# Altium project Test.PrjPcb
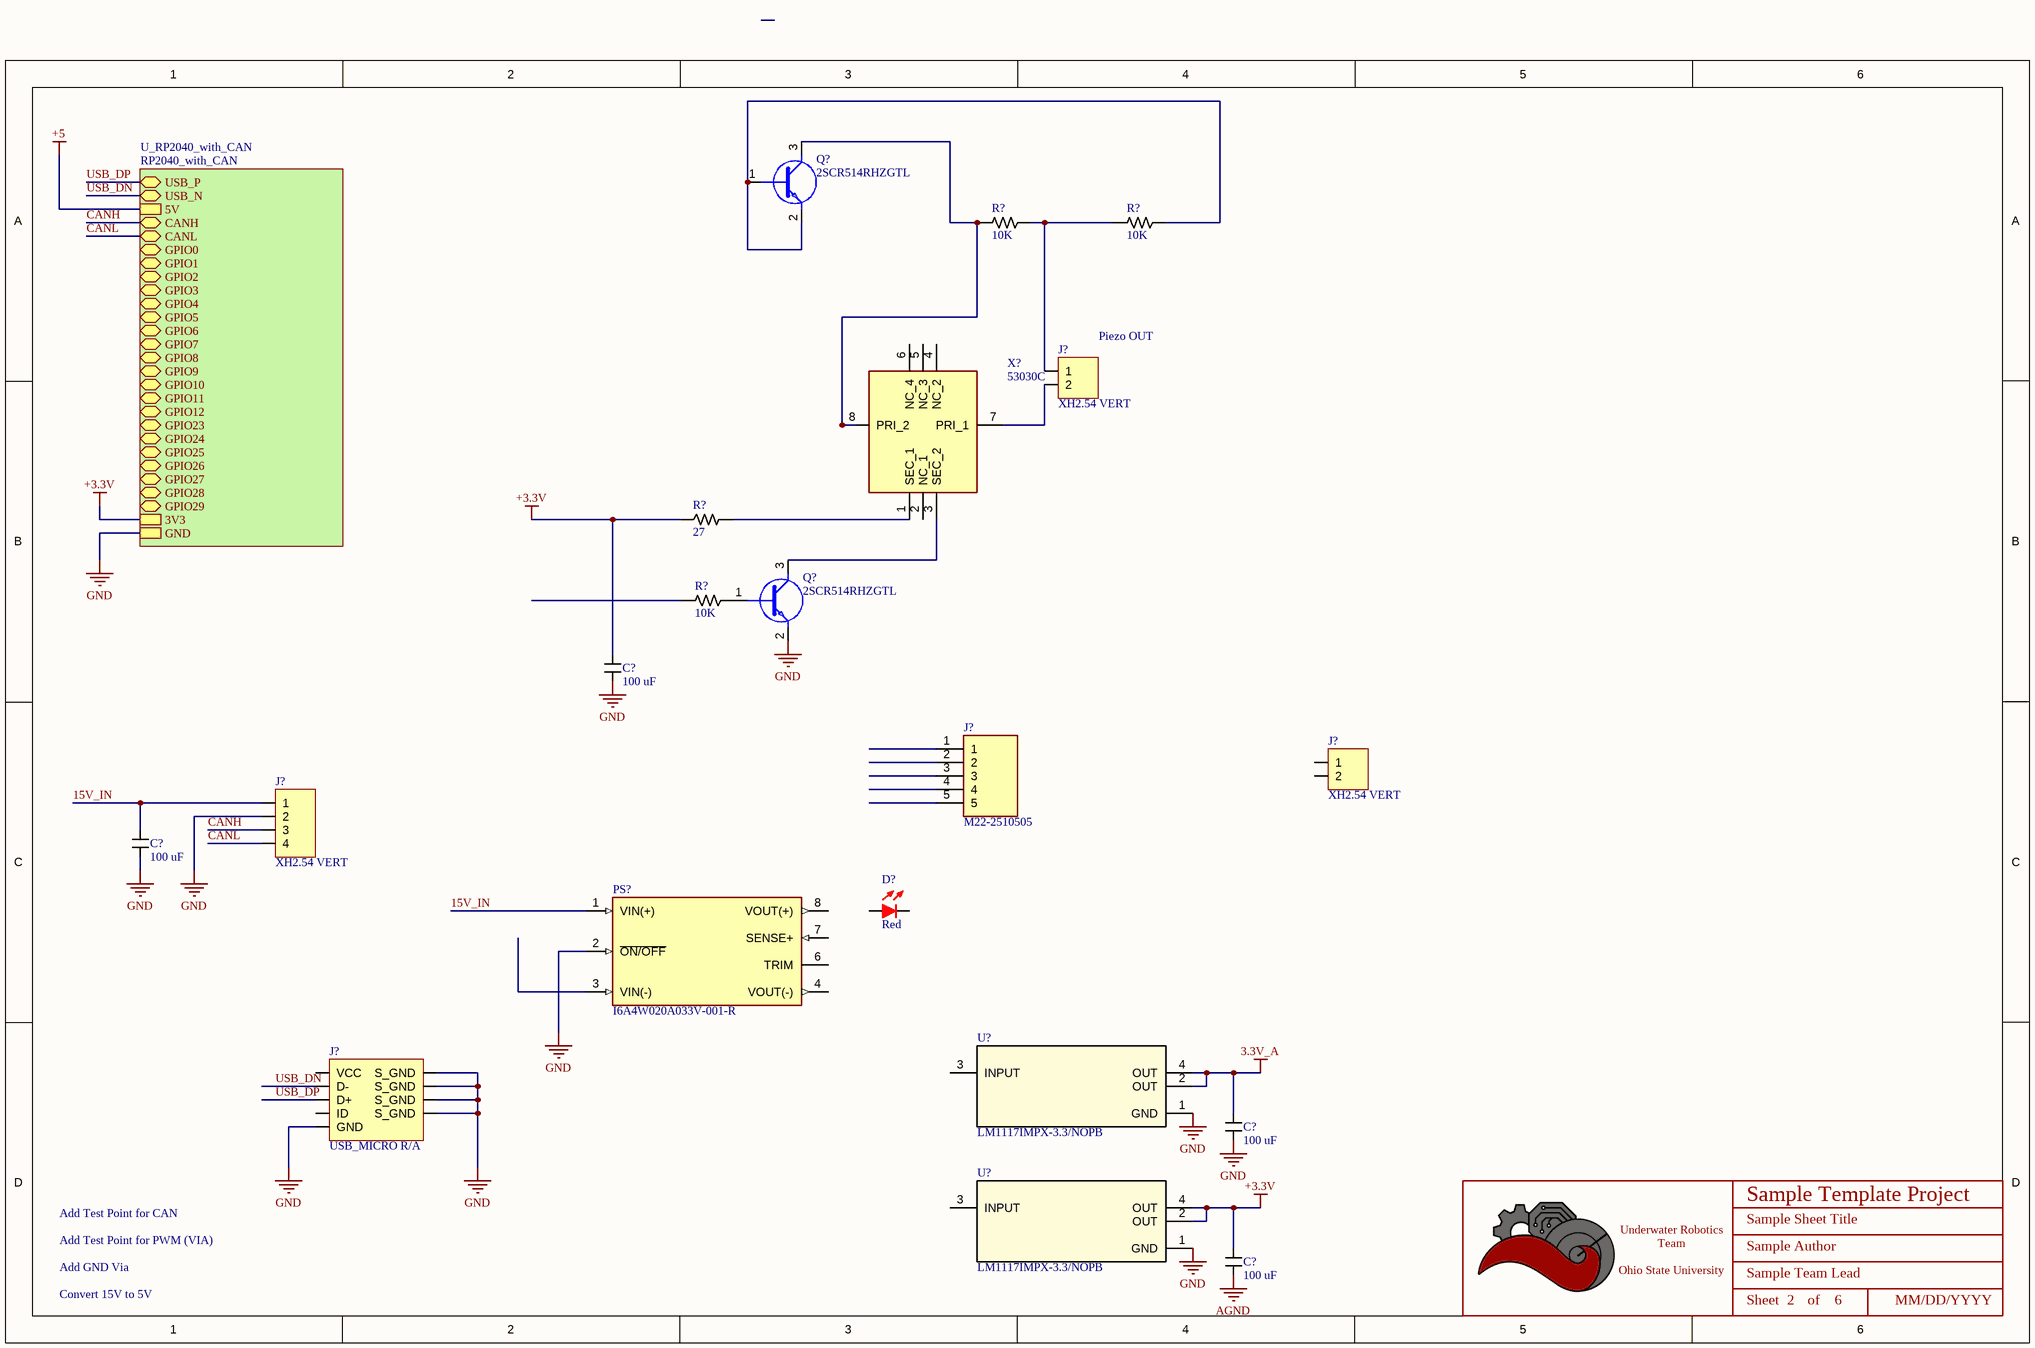
[diagram p0: Sch_Sheet_Template.SchDoc]
BoardRevision: 1.0; DateOfDesignReview: XX/XX/XXXX; ProjectTitle: Sample Template Project; TeamLead: Sample Team Lead
3 sheets, 46 parts. Net scope: hierarchical (ports join the sheet entries above them; power ports are global).
Board file: Pcb_4layer_4x4_Template.PcbDoc
Sheets:
  Sch_Sheet_Template.SchDoc
  TI_DSP.SchDoc
  Hydrophone.SchDoc

## Sheet Sch_Sheet_Template.SchDoc: Sample Sheet Title
size B; Date: MM/DD/YYYY; Author: Sample Author; Organization: ORGANIZATION; Address1: ADDRESS 1; Address2: ADDRESS 2; Address3: ADDRESS 3; Address4: ADDRESS 4; Revision: -; SheetNumber: 2; SheetTotal: 6; ENG_APP_DATE: --/--/--; DSN_APP_DATE: --/--/--; CHK_APP_DATE: --/--/--

### Parts
(Parts that share a designator on the sheet are numbered #1, #2 ... from top to bottom, then left to right.)
*#1  Title_Block  [LOGO]  (value not drawn)  (graphical)
C?#1  Value (uF): 100 uF  [CAPACITOR_0603]  (hidden comment: 100uF Ceramic 6.3V)
C?#2  Value (uF): 100 uF  [CAPACITOR_0603]  (hidden comment: 100uF Ceramic 6.3V)
C?#3  Value (uF): 100 uF  [CAPACITOR_0603]  (hidden comment: 100uF Ceramic 6.3V)
C?#4  Value (uF): 100 uF  [CAPACITOR_0603]  (hidden comment: 100uF Ceramic 6.3V)
D?#1  Color: Red  [LED_0603]  (hidden comment: 150060RS75000)
J?#1  XH2.54 VERT  [CONN_JST_XH254_2POS_VERT]
J?#2  M22-2510505  [HDRV5W50P0X200_1X5_1000X200X525P]
J?#3  XH2.54 VERT  [CONN_JST_XH254_2POS_VERT]
J?#4  XH2.54 VERT  [CONN_JST_XH254_4POS_VERT]
J?#5  USB_MICRO R/A  [CONN_MINIUSB]
PS?  I6A4W020A033V-001-R  [CONV_I6A4W020A033V-001-R]
Q?#1  2SCR514RHZGTL  [SOT95P280X100-3N]
Q?#2  2SCR514RHZGTL  [SOT95P280X100-3N]
R?#1  Value  (Ohms): 10K  [RESISTOR_0603]  (hidden comment: 10k Ohm 5% 1/10W)
R?#2  Value  (Ohms): 10K  [RESISTOR_0603]  (hidden comment: 10k Ohm 5% 1/10W)
R?#3  Value  (Ohms): 27  [RESISTOR_0603]  (hidden comment: 27 Ohm 5% 1/8W)
R?#4  Value  (Ohms): 10K  [RESISTOR_0603]  (hidden comment: 10k Ohm 5% 1/10W)
U?#1  LM1117IMPX-3.3/NOPB  [SOT-223-4]
U?#2  LM1117IMPX-3.3/NOPB  [SOT-223-4]
X?#1  53030C  [53030C]

### Sub-sheets
U_RP2040_with_CAN = RP2040_with_CAN (file not in this document): USB_P (bidir), USB_N (bidir), 5V, CANH (bidir), CANL (bidir), GPIO0 (bidir), GPIO1 (bidir), GPIO2 (bidir), GPIO3 (bidir), GPIO4 (bidir), GPIO5 (bidir), GPIO6 (bidir), GPIO7 (bidir), GPIO8 (bidir), GPIO9 (bidir), GPIO10 (bidir), GPIO11 (bidir), GPIO12 (bidir), GPIO23 (bidir), GPIO24 (bidir), GPIO25 (bidir), GPIO26 (bidir), GPIO27 (bidir), GPIO28 (bidir), GPIO29 (bidir), 3V3, GND

### Nets
3.3V_A: C?#3.1 U?#1.2(OUT) U?#1.4(OUT)
+3.3V: C?#1.1 C?#4.1 R?#3.2 U?#2.2(OUT) U?#2.4(OUT) ; sheet U_RP2040_with_CAN/3V3
AGND: C?#4.2
GND: C?#1.2 C?#2.2 C?#3.2 J?#4.2 J?#5.5(GND) J?#5.6(S_GND) J?#5.7(S_GND) J?#5.8(S_GND) J?#5.9(S_GND) PS?.2(~{ON/OFF}) Q?#2.2(E) U?#1.1(GND) U?#2.1(GND) ; sheet U_RP2040_with_CAN/GND  [project net +1.8]
15V_IN: C?#2.1 J?#4.1 PS?.1(VIN(+))
CANH: J?#4.3 ; sheet U_RP2040_with_CAN/CANH
CANL: J?#4.4 ; sheet U_RP2040_with_CAN/CANL
USB_DN: J?#5.2(D-) ; sheet U_RP2040_with_CAN/USB_N
USB_DP: J?#5.3(D+) ; sheet U_RP2040_with_CAN/USB_P
NetJ?#1_1: J?#1.1 R?#1.2 R?#2.1
NetJ?#1_2: J?#1.2 X?#1.7(PRI_1)
NetQ?#1_1: Q?#1.1(B) Q?#1.2(E) R?#2.2
NetQ?#1_3: Q?#1.3(C) R?#1.1 X?#1.8(PRI_2)
NetQ?#2_1: Q?#2.1(B) R?#4.2
NetQ?#2_3: Q?#2.3(C) X?#1.3(SEC_2)
NetR?#3_1: R?#3.1 X?#1.1(SEC_1)

Not connected (* = marked no-connect by the designer): D?#1 1 2; J?#2 1 2 3 4 5; J?#3 1 2; J?#5 1(VCC) 4(ID); PS? 3(VIN(-)) 4(VOUT(-)) 6(TRIM) 7(SENSE+) 8(VOUT(+)); R?#4 1; U?#1 3(INPUT); U?#2 3(INPUT); X?#1 2(NC_1) 4(NC_2) 5(NC_3) 6(NC_4)

### Notes on the sheet
- (near J?#1) Piezo OUT
- Add Test Point for CAN
- Add Test Point for PWM (VIA)
- Add GND Via
- Convert 15V to 5V
- DWG. NO.
- REV.
- SHT.
- THIS DOCUMENT AND THE DATA DISCLOSED HEREIN OR HEREWITH IS THE PROPERTY OF ALTIUM LIMITED AND MAY BE FREELY DISTRIBUTED IN WHOLE. NO RIGHTS ARE RESERVED OR EXPRESS OR IMPLIED WARANTEE GIVEN.
- REVISION
- DESCRIPTION
- DATE
- APPROVED
- ENG:
- APPROVALS
- PROJECT
- DSN:
- CHK:
- REFERENCE DOCUMENTS
- PROJECT REVISION:
- TITLE
- DOCUMENT REVISION:
- DESIGN ITEM:
- BOM:
- FAB DWG:
- PCB DWG:
- ASSY DWG:
- SCALE:
- SIZE
- B
- CAGE CODE
- FILE NAME
- DWG NO.
- SHEET
- OF
- REV
- (in symbol Title_Block) Underwater Robotics Team / Ohio State University; Sheet; of

### Library data of the parts
*#1 = Title_Block: UWRT Schematic Title Block Template / Created June 2021, Dylan Trainor
C?#1-C?#4 = CAPACITOR_100uF_0603: Cap 100uF 6.3V +/-20% / Ceramic 0603; Made By: Dylan Trainor; ComponentLink1Description: Digikey; ComponentLink1URL: https://www.digikey.com/en/products/detail/samsung-electro-mechanics/CL10A106MQ8NNNC/3886777; Tolerance: +/- 20%; Voltage: 6.3V; Supplier 1: RSComponents; Supplier Part Number 1: 6911206
D?#1 = LED_Red_0603: LED Red Vf= 2V If = 0.020A / 150060RS75000; Made By: Robert Pafford; Forward Current: 20mA; Forward Voltage: 2V; Package: 0603; Supplier 1: Digi-Key; Supplier Part Number 1: 732-4978-1-ND
J?#1 J?#3 = CONN_JST_XH254_2POS_VERT: JST XH 2.54mm Pitch 2 Pos Vertical; Current Per Pin: 4A; Number of Positions: 2; NOTE: Do not use JST 2.5mm parts with this footprint. JST does not make 2.54mm pitch pins, rather only clones make this connector!; Manufacturer: JST; Pitch: 2.54mm; Configuration: Vertical; Color: White; Created By: Robert P; Series: XH 2.54; ComponentLink1Description: Purchase Link; ComponentLink1URL: https://www.amazon.com/460PCS-XH2-54-Connector-Terminal-Connectors/dp/B09DBGVX5C
J?#2 = M22-2510505: Connector; Manufacturer_Name: Harwin; Datasheet Link: https://cdn.harwin.com/pdfs/M22-251.pdf; Height: 5.25mm; Manufacturer_Part_Number: M22-2510505; Mouser Part Number: 855-M22-2510505; Mouser Price/Stock: https://www.mouser.co.uk/ProductDetail/Harwin/M22-2510505?qs=WS5Jv%252B%252Bx1qWs6dQLMQlLFg%3D%3D
J?#4 = CONN_JST_XH254_4POS_VERT: JST XH 2.54mm Pitch 4 Pos Vertical; Current Per Pin: 4A; Number of Positions: 4; NOTE: Do not use JST 2.5mm parts with this footprint. JST does not make 2.54mm pitch pins, rather only clones make this connector!; Manufacturer: JST; Pitch: 2.54mm; Configuration: Vertical; Color: White; Created By: Robert P; Series: XH 2.54; ComponentLink1Description: Purchase Link; ComponentLink1URL: https://www.amazon.com/460PCS-XH2-54-Connector-Terminal-Connectors/dp/B09DBGVX5C
J?#5 = CONN_MICROUSB: Amphenol Micro USB-B / USB2.0 5 Pin Right Angle SMD; Pitch: 0.65mm; Current Per Pin: 1.8A; Number of Positions: 5; Manufacturer: Amphenol; Configuration: Right Angle; Color: Silver; Created By: Flip B; ComponentLink1Description: Datasheet; ComponentLink1URL: https://cdn.amphenol-icc.com/media/wysiwyg/files/documentation/datasheet/inputoutput/io_usb_micro.pdf?__cf_chl_jschl_tk__=05693735e19256298f6ef6ca2bb2e65c376a4f56-1625503833-0-Abitsb0-ufjOXJYs_S3J3r2iTn-nObalbmXUksF1VvO_h_WEmRdMlUD1I8-hmWSEVWzY1pirKnrPZWfgY3851qyBZe5ZvnNQePLGIzUgdEIQBVUyW36RsbYpDLEWxJ4horD-5gChFgobLYqwmG5aHl0E8lIn_twwPPrOxilK2gP0q9t_CNOs_u5fMqXvXUrlsOv8tIE2NRlu6NVP8qtkL2GjhlkeTUbDMF8WvvpPDTFOgvZ4Y16Ej8F8AhWos88mo5B1HssXozw0XrkJQIqERITUu6rqloz9kf4ZzhBHtDAt-IkiAFY_Ds9SW8FYKKTtINJVpHZQ6Gyu1FFM4Dc9MO0maE8_mmNcwlxqyRoRk_MPWW8VyByXWM5RSp52jteRKw7FeI9WIYvCbPAOy0Eyib-aseIQsnGbglBcUY6_2xp8GYaJM38H3dNvBPsSOfJBPndKedwKHllxjkucXn6xsN0sDXkpGN-cu8_2bDTJ0g-uUucKSCooYX-ApSDNGpkA_p9zv1SOAD8c0zaZVmtiBsN75QpVz2rzq9_BFxOywPvR; Series: 10118192; Supplier 1: Digi-Key; Supplier Part Number 1: 609-4613-1-ND
PS? = I6A4W020A033V-001-R: Non-Isolated PoL Module DC DC Converter 1 Output 3.3 ~ 15V 20A 9V - 53V Input; MF: TDK-Lambda Americas; Availability: In Stock; Price: None; Package: DIP-8 TDK-Lambda; MP: I6A4W020A033V-001-R; Value: *; SnapEDA_Link: https://www.snapeda.com/parts/I6A4W020A033V-001-R/TDK-Lambda%20Americas%20Inc./view-part/1737324/?ref=snap; Check_prices: https://www.snapeda.com/parts/I6A4W020A033V-001-R/TDK-Lambda%20Americas%20Inc./view-part/1737324/?ref=eda; Purchase-URL: https://pricing.snapeda.com/search/part/I6A4W020A033V-001-R/?ref=eda
Q?#1 Q?#2 = 2SCR514RHZGTL: Bipolar (BJT) Transistor NPN 80 V 700 mA 320MHz 500 mW Surface Mount TSMT3; Manufacturer_Name: ROHM Semiconductor; Geometry.Height: 1mm; Mouser Part Number: 755-2SCR514RHZGTL; Mouser Price/Stock: https://www.mouser.co.uk/ProductDetail/ROHM-Semiconductor/2SCR514RHZGTL?qs=Znm5pLBrcAJoNmVRhw7gxA%3D%3D; Manufacturer_Part_Number: 2SCR514RHZGTL; Datasheet Link: *
R?#1 R?#2 R?#4 = RESISTOR_10K_0603: RES 10k OHM 5% 1/10W 0603; Tolerance: +/- 5%; Wattage: 1/8W; Made By: Robert Pafford; ComponentLink1Description: Datasheet; ComponentLink1URL: https://www.bourns.com/docs/product-datasheets/CRxxxxx.pdf; Supplier: Digikey; Digikey Part Numer: CR0603-JW-104ELFTR-ND; Supplier 1: Digi-Key; Supplier Part Number 1: 2019-RK73B1JTTD103JCT-ND
R?#3 = RESISTOR_27_0603: RES 27 OHM 5% 1/8W 0603; Tolerance: +/- 5%; Made By: Robert Pafford; ComponentLink1Description: Datasheet; ComponentLink1URL: https://www.bourns.com/docs/product-datasheets/CRxxxxx.pdf; Wattage: 1/8W; Supplier: Digikey; Digikey Part Numer: CR0603-JW-104ELFTR-ND; Supplier 1: Digi-Key; Supplier Part Number 1: 2019-RK73B1JTTD270JCT-ND
U?#1 U?#2 = LM1117IMPX-3.3/NOPB: IC REG LIN 3.3V 800MA SOT223-4; PartNumber: LM1117IMP-3.3/NOPB; Manufacturer: Texas Instruments; Vin (Max): 15V; Supplier 1: Digi-Key; Supplier Part Number 1: LM1117IMPX-3.3/NOPBCT-ND; Vout (Min/Fixed): 3.3V; Amp Out: 800mA; Package: SOT-223-4; Created By: Dylan T
X?#1 = 53030C: Current Transformers 10A Curr Sense Txfr 1:30 SM; Manufacturer_Name: Murata Electronics; Geometry.Height: 5.4mm; Mouser Part Number: 580-53030C; Mouser Price/Stock: https://www.mouser.com/Search/Refine.aspx?Keyword=580-53030C; Manufacturer_Part_Number: 53030C; Datasheet Link: https://componentsearchengine.com/Datasheets/1/53030C.pdf

## Sheet TI_DSP.SchDoc: Sample Sheet Title
size B; Date: MM/DD/YYYY; Author: Sample Author; Organization: ORGANIZATION; Address1: ADDRESS 1; Address2: ADDRESS 2; Address3: ADDRESS 3; Address4: ADDRESS 4; Revision: -; SheetNumber: 3; SheetTotal: 6; ENG_APP_DATE: --/--/--; DSN_APP_DATE: --/--/--; CHK_APP_DATE: --/--/--
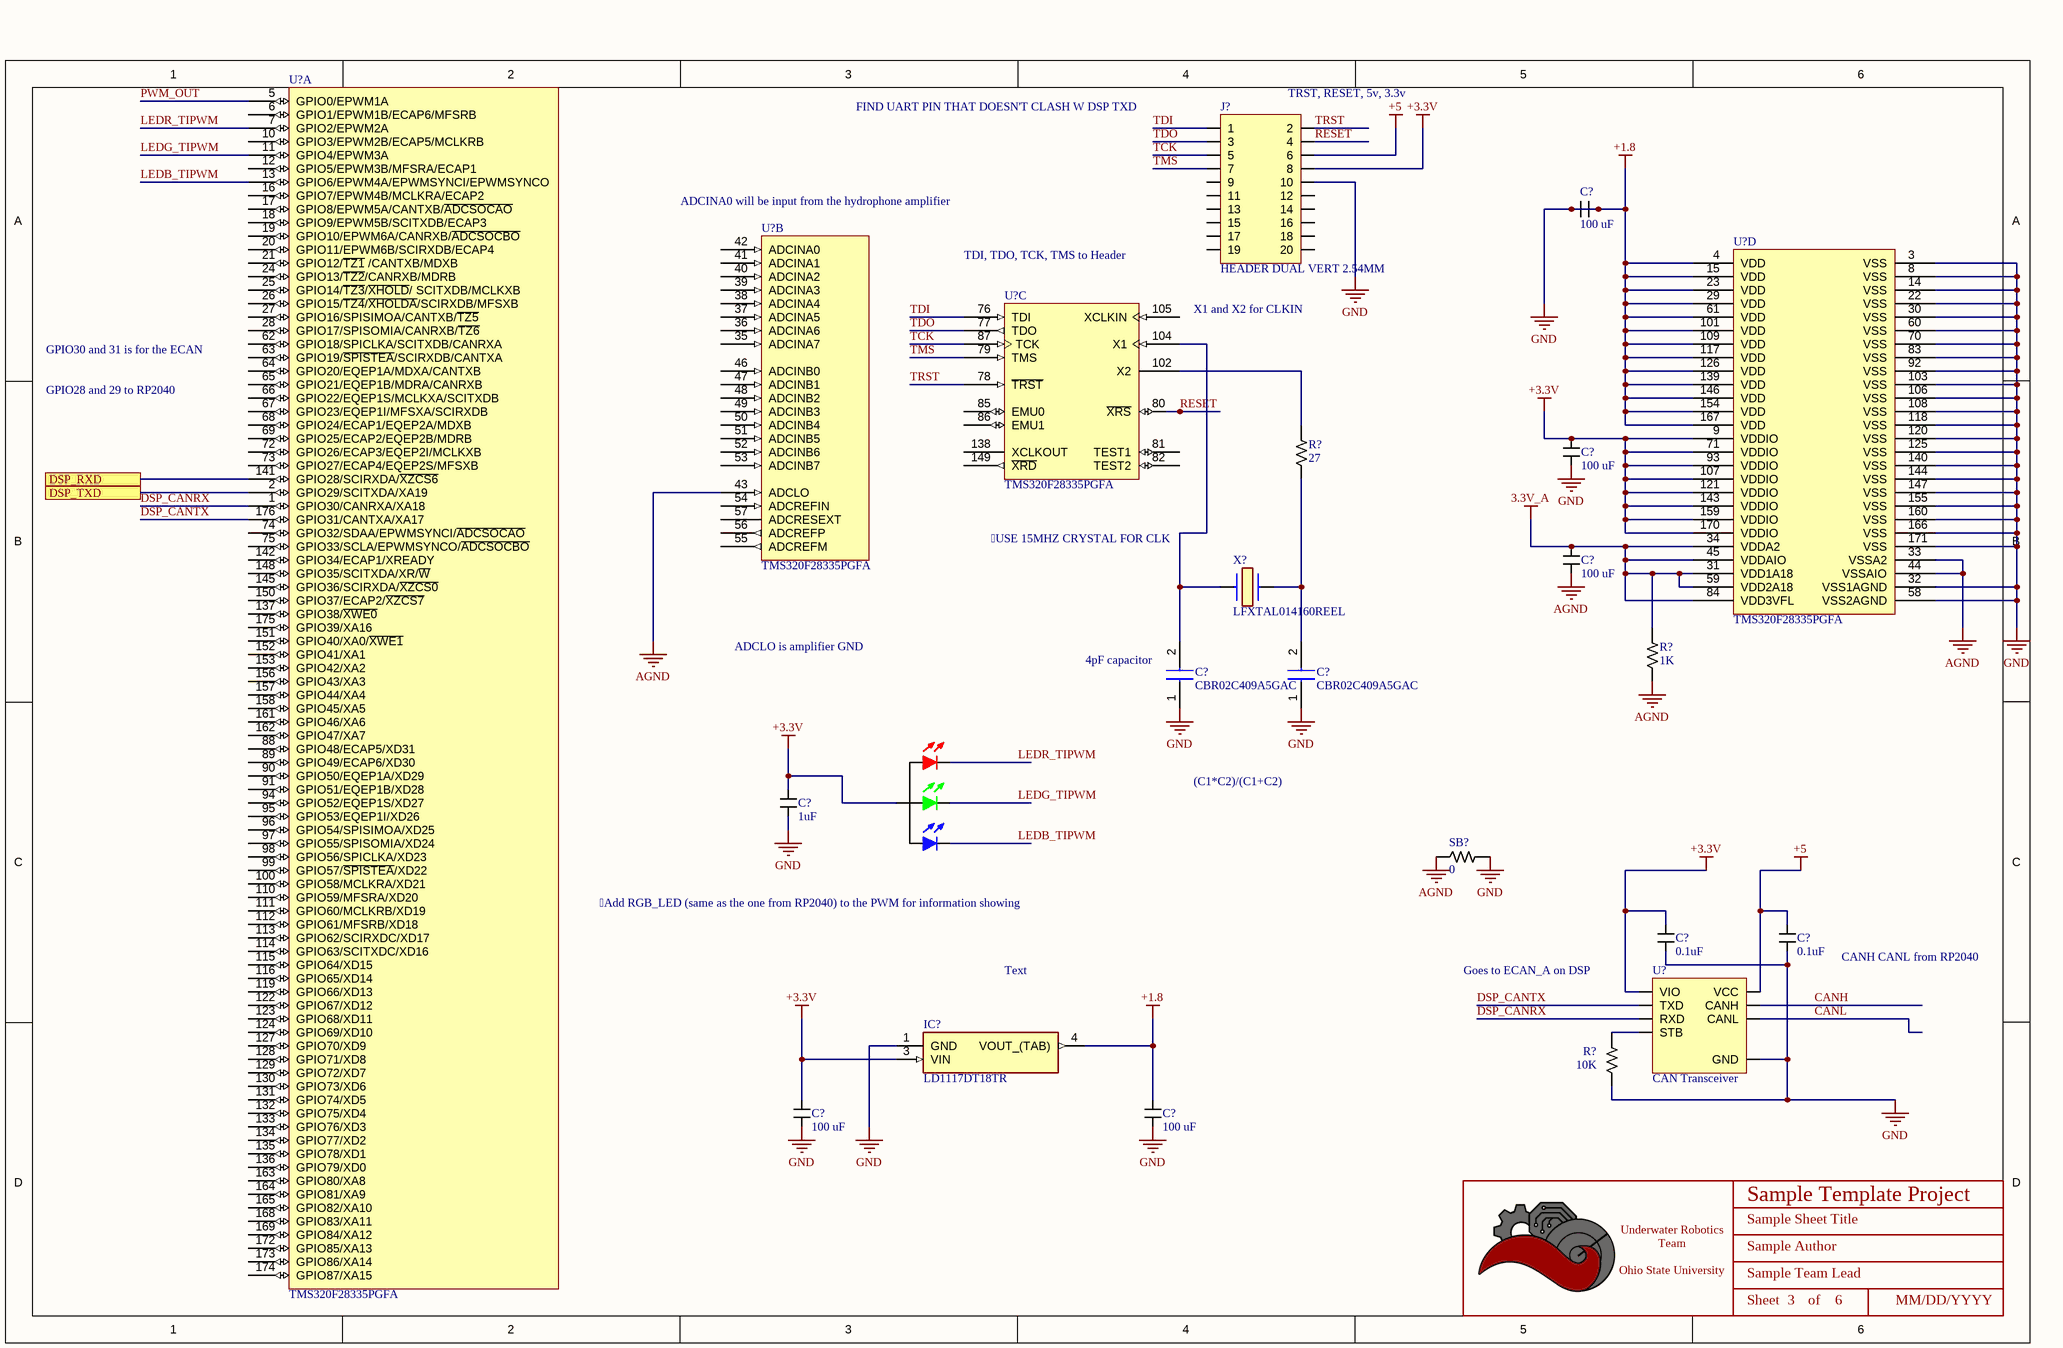
[diagram p1: TI_DSP.SchDoc]

### Parts
(Parts that share a designator on the sheet are numbered #1, #2 ... from top to bottom, then left to right.)
*#2  Title_Block  [LOGO]  (value not drawn)  (graphical)
C?#5  Value (uF): 100 uF  [CAPACITOR_0603]  (hidden comment: 100uF Ceramic 6.3V)
C?#6  Value (uF): 100 uF  [CAPACITOR_0603]  (hidden comment: 100uF Ceramic 6.3V)
C?#7  Value (uF): 100 uF  [CAPACITOR_0603]  (hidden comment: 100uF Ceramic 6.3V)
C?#8  CBR02C409A5GAC  [CAPC0603X33N]
C?#9  CBR02C409A5GAC  [CAPC0603X33N]
C?#10  value 1uF  [CAPACITOR_0603]  (hidden comment: 1uF Ceramic 16V)
C?#11  value 0.1uF  [CAPACITOR_0402]  (hidden comment: 100nF Ceramic 25V)
C?#12  value 0.1uF  [CAPACITOR_0402]  (hidden comment: 100nF Ceramic 25V)
C?#13  Value (uF): 100 uF  [CAPACITOR_0603]  (hidden comment: 100uF Ceramic 6.3V)
C?#14  Value (uF): 100 uF  [CAPACITOR_0603]  (hidden comment: 100uF Ceramic 6.3V)
D?#2  EASV3015RGBA0  [LED_4-SMD]  (value not drawn)
IC?  LD1117DT18TR  [TO228P972X240-3N]
J?#6  HEADER DUAL VERT 2.54MM  [HEADER_2x10PIN_2.54MM]
R?#5  Value  (Ohms): 27  [RESISTOR_0603]  (hidden comment: 27 Ohm 5% 1/8W)
R?#6  Value  (Ohms): 1K  [RESISTOR_0603]  (hidden comment: 1k Ohm 5% 1/8W)
R?#7  Value  (Ohms): 10K  [RESISTOR_0402]  (hidden comment: 10k Ohm 1% 1/16W)
SB?  Value  (Ohms): 0  [RESISTOR_0603]  (hidden comment: 0 Ohm Jumper No Fit)
U?#3  TMS320F28335PGFA  [PGF0176A_M]  (part A of 4)
U?#4  TMS320F28335PGFA  [PGF0176A_M]  (part B of 4)
U?#5  TMS320F28335PGFA  [PGF0176A_M]  (part D of 4)
U?#6  TMS320F28335PGFA  [PGF0176A_M]  (part C of 4)
U?#7  CAN Transceiver  [SOIC-8]
X?#2  LFXTAL014160REEL  [LFXTAL014160REEL]

### Ports
DSP_RXD, DSP_TXD

### Nets
3.3V_A: C?#7.1 R?#6.1 U?#5.31(VDD1A18) U?#5.34(VDDA2) U?#5.45(VDDAIO) U?#5.59(VDD2A18) U?#5.84(VDD3VFL)
+1.8: C?#5.1 C?#5.2 C?#6.2 C?#8.1 C?#9.1 C?#10.2 C?#11.2 C?#12.2 C?#13.2 C?#14.1 C?#14.2 IC?.1(GND) IC?.4(VOUT_(TAB)) J?#6.10 R?#7.2 SB?.1 U?#5.3(VSS) U?#5.4(VDD) U?#5.8(VSS) U?#5.14(VSS) U?#5.15(VDD) U?#5.22(VSS) U?#5.23(VDD) U?#5.29(VDD) U?#5.30(VSS) U?#5.32(VSS1AGND) U?#5.58(VSS2AGND) U?#5.60(VSS) U?#5.61(VDD) U?#5.70(VSS) U?#5.83(VSS) U?#5.92(VSS) U?#5.101(VDD) U?#5.103(VSS) U?#5.106(VSS) U?#5.108(VSS) U?#5.109(VDD) U?#5.117(VDD) U?#5.118(VSS) U?#5.120(VSS) U?#5.125(VSS) U?#5.126(VDD) U?#5.139(VDD) U?#5.140(VSS) U?#5.144(VSS) U?#5.146(VDD) U?#5.147(VSS) U?#5.154(VDD) U?#5.155(VSS) U?#5.160(VSS) U?#5.166(VSS) U?#5.167(VDD) U?#5.171(VSS) U?#7.2(GND)  [also labelled GND]
+3.3V: C?#6.1 C?#10.1 C?#11.1 C?#13.1 D?#2.1 IC?.3(VIN) J?#6.8 U?#5.9(VDDIO) U?#5.71(VDDIO) U?#5.93(VDDIO) U?#5.107(VDDIO) U?#5.121(VDDIO) U?#5.143(VDDIO) U?#5.159(VDDIO) U?#5.170(VDDIO) U?#7.5(VIO)
+5: C?#12.1 J?#6.6 U?#7.3(VCC)
AGND: C?#7.2 R?#6.2 SB?.2 U?#4.43(ADCLO) U?#5.33(VSSA2) U?#5.44(VSSAIO)
CANH: U?#7.7(CANH)
CANL: U?#7.6(CANL)
DSP_CANRX: U?#3.1(GPIO30/CANRXA/XA18) U?#7.4(RXD)
DSP_CANTX: U?#3.176(GPIO31/CANTXA/XA17) U?#7.1(TXD)
LEDB_TIPWM: D?#2.2 U?#3.13(GPIO6/EPWM4A/EPWMSYNCI/EPWMSYNCO)
LEDG_TIPWM: D?#2.3 U?#3.11(GPIO4/EPWM3A)
LEDR_TIPWM: D?#2.4 U?#3.7(GPIO2/EPWM2A)
PWM_OUT: U?#3.5(GPIO0/EPWM1A)
RESET: J?#6.4 U?#6.80(~{XRS})
TCK: J?#6.5 U?#6.87(TCK)
TDI: J?#6.1 U?#6.76(TDI)
TDO: J?#6.3 U?#6.77(TDO)
TMS: J?#6.7 U?#6.79(TMS)
TRST: J?#6.2 U?#6.78(~{TRST})
NetC?#8_2: C?#8.2 U?#6.104(X1) X?#2.1
NetC?#9_2: C?#9.2 R?#5.2 X?#2.2
NetR?#5_1: R?#5.1 U?#6.102(X2)
NetR?#7_1: R?#7.1 U?#7.8(STB)
NetU?#3_2: U?#3.2(GPIO29/SCITXDA/XA19) ; port DSP_TXD
NetU?#3_141: U?#3.141(GPIO28/SCIRXDA/~{XZCS6}) ; port DSP_RXD

Not connected (* = marked no-connect by the designer): J?#6 9 11 12 13 14 15 16 17 18 19 20; U?#3 6(GPIO1/EPWM1B/ECAP6/MFSRB) 10(GPIO3/EPWM2B/ECAP5/MCLKRB) 12(GPIO5/EPWM3B/MFSRA/ECAP1) 16(GPIO7/EPWM4B/MCLKRA/ECAP2) 17(GPIO8/EPWM5A/CANTXB/~{ADCSOCAO}) 18(GPIO9/EPWM5B/SCITXDB/ECAP3) 19(GPIO10/EPWM6A/CANRXB/~{ADCSOCBO}) 20(GPIO11/EPWM6B/SCIRXDB/ECAP4) 21(GPIO12/~{TZ1}_/CANTXB/MDXB) 24(GPIO13/~{TZ2}/CANRXB/MDRB) 25(GPIO14/~{TZ3}/~{XHOLD}/_SCITXDB/MCLKXB) 26(GPIO15/~{TZ4}/~{XHOLDA}/SCIRXDB/MFSXB) 27(GPIO16/SPISIMOA/CANTXB/~{TZ5}) 28(GPIO17/SPISOMIA/CANRXB/~{TZ6}) 62(GPIO18/SPICLKA/SCITXDB/CANRXA) 63(GPIO19/~{SPISTEA}/SCIRXDB/CANTXA) 64(GPIO20/EQEP1A/MDXA/CANTXB) 65(GPIO21/EQEP1B/MDRA/CANRXB) 66(GPIO22/EQEP1S/MCLKXA/SCITXDB) 67(GPIO23/EQEP1I/MFSXA/SCIRXDB) 68(GPIO24/ECAP1/EQEP2A/MDXB) 69(GPIO25/ECAP2/EQEP2B/MDRB) 72(GPIO26/ECAP3/EQEP2I/MCLKXB) 73(GPIO27/ECAP4/EQEP2S/MFSXB) 74(GPIO32/SDAA/EPWMSYNCI/~{ADCSOCAO}) 75(GPIO33/SCLA/EPWMSYNCO/~{ADCSOCBO}) 88(GPIO48/ECAP5/XD31) 89(GPIO49/ECAP6/XD30) 90(GPIO50/EQEP1A/XD29) 91(GPIO51/EQEP1B/XD28) 94(GPIO52/EQEP1S/XD27) 95(GPIO53/EQEP1I/XD26) 96(GPIO54/SPISIMOA/XD25) 97(GPIO55/SPISOMIA/XD24) 98(GPIO56/SPICLKA/XD23) 99(GPIO57/~{SPISTEA}/XD22) 100(GPIO58/MCLKRA/XD21) 110(GPIO59/MFSRA/XD20) 111(GPIO60/MCLKRB/XD19) 112(GPIO61/MFSRB/XD18) 113(GPIO62/SCIRXDC/XD17) 114(GPIO63/SCITXDC/XD16) 115(GPIO64/XD15) 116(GPIO65/XD14) 119(GPIO66/XD13) 122(GPIO67/XD12) 123(GPIO68/XD11) 124(GPIO69/XD10) 127(GPIO70/XD9) 128(GPIO71/XD8) 129(GPIO72/XD7) 130(GPIO73/XD6) 131(GPIO74/XD5) 132(GPIO75/XD4) 133(GPIO76/XD3) 134(GPIO77/XD2) 135(GPIO78/XD1) 136(GPIO79/XD0) 137(GPIO38/~{XWE0}) 142(GPIO34/ECAP1/XREADY) 145(GPIO36/SCIRXDA/~{XZCS0}) 148(GPIO35/SCITXDA/XR/~{W}) 150(GPIO37/ECAP2/~{XZCS7}) 151(GPIO40/XA0/~{XWE1}__) 152(GPIO41/XA1) 153(GPIO42/XA2) 156(GPIO43/XA3) 157(GPIO44/XA4) 158(GPIO45/XA5) 161(GPIO46/XA6) 162(GPIO47/XA7) 163(GPIO80/XA8) 164(GPIO81/XA9) 165(GPIO82/XA10) 168(GPIO83/XA11) 169(GPIO84/XA12) 172(GPIO85/XA13) 173(GPIO86/XA14) 174(GPIO87/XA15) 175(GPIO39/XA16); U?#4 35(ADCINA7) 36(ADCINA6) 37(ADCINA5) 38(ADCINA4) 39(ADCINA3) 40(ADCINA2) 41(ADCINA1) 42(ADCINA0) 46(ADCINB0) 47(ADCINB1) 48(ADCINB2) 49(ADCINB3) 50(ADCINB4) 51(ADCINB5) 52(ADCINB6) 53(ADCINB7) 54(ADCREFIN) 55(ADCREFM) 56(ADCREFP) 57(ADCRESEXT); U?#6 81(TEST1) 82(TEST2) 85(EMU0) 86(EMU1) 105(XCLKIN) 138(XCLKOUT) 149(~{XRD})

### Notes on the sheet
- FIND UART PIN THAT DOESN'T CLASH W DSP TXD
- (near J?#6) TRST, RESET, 5v, 3.3v
- (near U?#4) ADCINA0 will be input from the hydrophone amplifier
- TDI, TDO, TCK, TMS to Header
- GPIO30 and 31 is for the ECAN
- X1 and X2 for CLKIN
- GPIO28 and 29 to RP2040
- USE 15MHZ CRYSTAL FOR CLK
- ADCLO is amplifier GND
- (near C?#8) 4pF capacitor
- (C1*C2)/(C1+C2)
- Add RGB_LED (same as the one from RP2040) to the PWM for information showing
- CANH CANL from RP2040
- Text
- Goes to ECAN_A on DSP
- DWG. NO.
- REV.
- SHT.
- THIS DOCUMENT AND THE DATA DISCLOSED HEREIN OR HEREWITH IS THE PROPERTY OF ALTIUM LIMITED AND MAY BE FREELY DISTRIBUTED IN WHOLE. NO RIGHTS ARE RESERVED OR EXPRESS OR IMPLIED WARANTEE GIVEN.
- REVISION
- DESCRIPTION
- DATE
- APPROVED
- ENG:
- APPROVALS
- PROJECT
- DSN:
- CHK:
- REFERENCE DOCUMENTS
- PROJECT REVISION:
- TITLE
- DOCUMENT REVISION:
- DESIGN ITEM:
- BOM:
- FAB DWG:
- PCB DWG:
- ASSY DWG:
- SCALE:
- SIZE
- B
- CAGE CODE
- FILE NAME
- DWG NO.
- SHEET
- OF
- REV
- (in symbol Title_Block) Underwater Robotics Team / Ohio State University; Sheet; of

### Library data of the parts
*#2 = Title_Block: as *#1 on sheet Sch_Sheet_Template
C?#5-C?#7 C?#13 C?#14 = CAPACITOR_100uF_0603: as C?#1 on sheet Sch_Sheet_Template; ComponentLink1Description: Digikey; ComponentLink1URL: https://www.digikey.com/en/products/detail/samsung-electro-mechanics/CL10A106MQ8NNNC/3886777; Tolerance: +/- 20%; Voltage: 6.3V; Supplier 1: RSComponents; Supplier Part Number 1: 6911206
C?#8 C?#9 = CBR02C409A5GAC: Capacitor; Manufacturer_Name: KEMET; Datasheet Link: http://www.kemet.com/Lists/ProductCatalog/Attachments/490/KEM_C1030_CBR_SMD.pdf; Height: 0.33mm; Manufacturer_Part_Number: CBR02C409A5GAC
C?#10 = CAPACITOR_1uF_0603: Cap 1uF 16V +/-10% / Ceramic 0603; Made By: Flip B; Tolerance: +/- 10%; Voltage: 16V; Supplier 1: Digi-Key; Supplier Part Number 1: 399-7847-1-ND
C?#11 C?#12 = CAPACITOR_0.1uF_0402: Cap 100nF 25V +/-10% / Ceramic 0402; Made By: Robert Pafford; Tolerance: +/- 10%; Voltage: 25V; Supplier 1: Digi-Key; Supplier Part Number 1: 478-7868-1-ND
D?#2 = LED_RGB_RA_4SMD: LED RGB CLEAR 4SMD R/A; Made By: Robert Pafford; Red Forward Voltage: 2.0V; Red Forward Current: 25mA; Green Forward Voltage: 3.3V; Blue Forward Current: 20mA; ComponentLink1Description: Datasheet; ComponentLink1URL: https://everlightamericas.com/index.php?controller=attachment&id_attachment=3220; Package: 4-SMD; Green Forward Current: 25mA; Blue Forward Voltage: 3.3V; Color: RGB; Supplier 1: Digi-Key; Supplier Part Number 1: 1080-1502-1-ND; Supplier 2: Mouser; Supplier Part Number 2: 638-EASV3015RGBA0
IC? = LD1117DT18TR: Integrated Circuit; Manufacturer_Name: STMicroelectronics; Datasheet Link: http://www.st.com/st-web-ui/static/active/en/resource/technical/document/datasheet/CD00000544.pdf; Height: 2.4mm; Manufacturer_Part_Number: LD1117DT18TR; Mouser Part Number: 511-LD1117DT18-TR; Mouser Price/Stock: https://www.mouser.co.uk/ProductDetail/STMicroelectronics/LD1117DT18TR?qs=rkyzKKi%2FrgiTGfkwrcFd%252BA%3D%3D; Arrow Part Number: LD1117DT18TR; Arrow Price/Stock: https://www.arrow.com/en/products/ld1117dt18tr/stmicroelectronics?region=nac
J?#6 = HEADER_2x10PIN_2.54MM: CONN HEADER VERT 20POS 2.54MM; Made By: Tyson Nguyen; Supplier 1: Digi-Key; Supplier Part Number 1: Z8747-ND
R?#5 = RESISTOR_27_0603: as R?#3 on sheet Sch_Sheet_Template; ComponentLink1Description: Datasheet; ComponentLink1URL: https://www.bourns.com/docs/product-datasheets/CRxxxxx.pdf; Wattage: 1/8W; Supplier: Digikey; Digikey Part Numer: CR0603-JW-104ELFTR-ND; Supplier 1: Digi-Key; Supplier Part Number 1: 2019-RK73B1JTTD270JCT-ND
R?#6 = RESISTOR_1K_0603: RES 1k OHM 5% 1/8W 0603; Tolerance: +/- 5%; Made By: Robert Pafford; ComponentLink1Description: Datasheet; ComponentLink1URL: https://www.bourns.com/docs/product-datasheets/CRxxxxx.pdf; Wattage: 1/8W; Supplier: Digikey; Digikey Part Numer: CR0603-JW-104ELFTR-ND; Supplier 1: Digi-Key; Supplier Part Number 1: 2019-RK73B1JTTD102JCT-ND
R?#7 = RESISTOR_10K_0402: RES 10k OHM 1% 1/16W 0402; Tolerance: +/- 1%; Made By: Robert Pafford; Wattage: 1/16W; Supplier: Digikey; Digikey Part Numer: CR0603-JW-104ELFTR-ND; Supplier 1: Digi-Key; Supplier Part Number 1: YAG3436CT-ND
SB? = JUMPER_0_0603: 0 Ohm Jumper No Fit for Solder Bridge; Made By: Robert Pafford; ComponentLink1Description: Digikey; ComponentLink1URL: https://www.digikey.com/en/products/detail/koa-speer-electronics-inc/RK73B1JTTD101J/9844701
U?#3-U?#6 = CMP-0546-00022-3: Delfino Microcontroller, 1.9 V Core, 3.3 V I/O Design, 256 K x 16 Flash, 34 K x 16 SARAM, 12-Bit ADC, 16 Channels, -40 to 85 degC, 176-pin LQFP (PGF), Green (RoHS & no Sb/Br); Manufacturer: Texas Instruments; 12-Bit ADC No. Of Channels: 16; SPI: 1; GPIO: 88; Frequency (MHz): 150; CAN: 2; ComponentLink2Description: Datasheet; ComponentLink3URL: http://www.ti.com/lit/ml/mtqf020a/mtqf020a.pdf; Mounting Technology: Surface Mount; ComponentLink1Description: Manufacturer URL; I2C: 1; PartNumber: TMS320F28335PGFA; PackageVersion: 4040134/B; ComponentLink2URL: http://www.ti.com/lit/ds/symlink/tms320f28335.pdf; ComponentLink1URL: http://www.ti.com/; Eco Plan: Green (RoHS & no Sb/Br); PackageDescription: 176-Pin Plastic Quad Flatpack, Body 24 x 24 mm, Pitch 0.5 mm; ComponentLink3Description: Package Specification; Operating Temperature: -40 to 85 degC; DatasheetVersion: SPRS439M; PackageReference: PGF0176A
U?#7 = TJA1442AT: CAN Interface IC High-Speed CAN Transceiver with Standby Mode; Made By: Robert Pafford; Max Data Rate: 5Mbps; Supplier 1: Mouser; Supplier Part Number 1: 771-TJA1442AT/0Z
X?#2 = LFXTAL014160REEL: Industry standard low cost SMD crystal package Low profile versions available SMD version of model HC49/4H; Manufacturer_Name: IQD; Geometry.Height: 4.3mm; Mouser Part Number: *; Mouser Price/Stock: *; Manufacturer_Part_Number: LFXTAL014160REEL; Datasheet Link: https://www.iqdfrequencyproducts.com/products/details/hc49-4hsmx.pdf

## Sheet Hydrophone.SchDoc: Sample Sheet Title
size B; Date: MM/DD/YYYY; Author: Sample Author; Organization: ORGANIZATION; Address1: ADDRESS 1; Address2: ADDRESS 2; Address3: ADDRESS 3; Address4: ADDRESS 4; Revision: -; SheetNumber: 4; SheetTotal: 6; ENG_APP_DATE: --/--/--; DSN_APP_DATE: --/--/--; CHK_APP_DATE: --/--/--
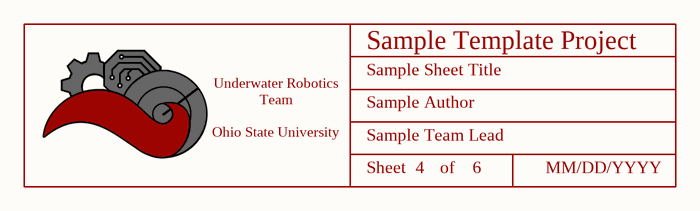
[diagram p2: Hydrophone.SchDoc]

### Parts
(Parts that share a designator on the sheet are numbered #1, #2 ... from top to bottom, then left to right.)
*#3  Title_Block  [LOGO]  (value not drawn)  (graphical)

### Notes on the sheet
- DWG. NO.
- REV.
- SHT.
- THIS DOCUMENT AND THE DATA DISCLOSED HEREIN OR HEREWITH IS THE PROPERTY OF ALTIUM LIMITED AND MAY BE FREELY DISTRIBUTED IN WHOLE. NO RIGHTS ARE RESERVED OR EXPRESS OR IMPLIED WARANTEE GIVEN.
- REVISION
- DESCRIPTION
- DATE
- APPROVED
- ENG:
- APPROVALS
- PROJECT
- DSN:
- CHK:
- REFERENCE DOCUMENTS
- PROJECT REVISION:
- TITLE
- DOCUMENT REVISION:
- DESIGN ITEM:
- BOM:
- FAB DWG:
- PCB DWG:
- ASSY DWG:
- SCALE:
- SIZE
- B
- CAGE CODE
- FILE NAME
- DWG NO.
- SHEET
- OF
- REV
- (in symbol Title_Block) Underwater Robotics Team / Ohio State University; Sheet; of

### Library data of the parts
*#3 = Title_Block: as *#1 on sheet Sch_Sheet_Template

## Nets that join several sheets
3.3V_A: Sch_Sheet_Template (C?#3.1 U?#1.2 U?#1.4), TI_DSP (7 pins)
+1.8: Sch_Sheet_Template (13 pins), TI_DSP (54 pins)
+3.3V: Sch_Sheet_Template (5 pins), TI_DSP (16 pins)
AGND: Sch_Sheet_Template (C?#4.2), TI_DSP (6 pins)